# EAGLE design SwitchTester (EAGLE 7.7.0)
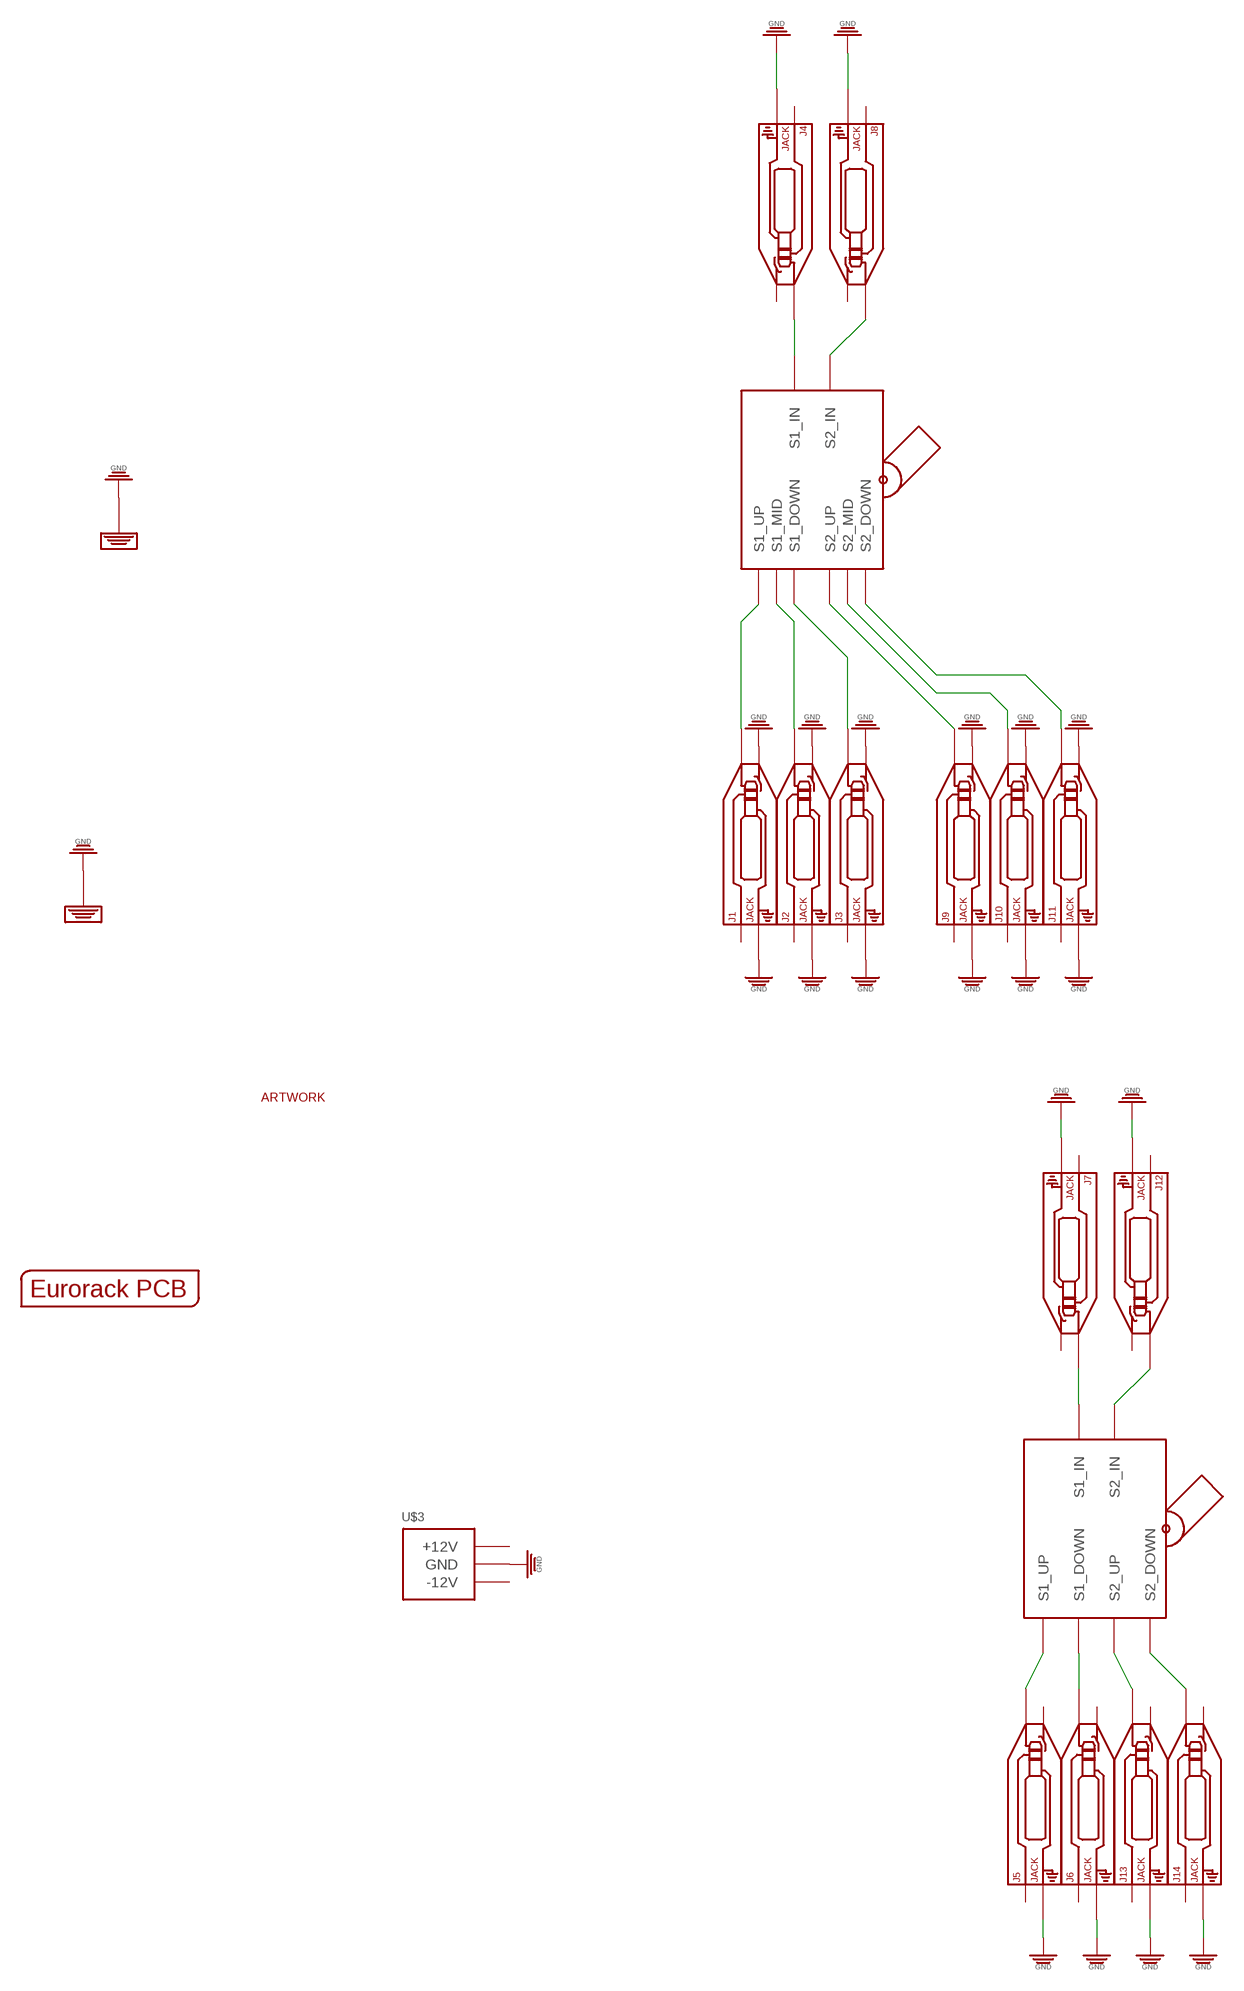
[diagram p0: schematic, sheet 1]

## Parts
J1  JACK  AUDIO-JACK_SMALLSYMBOLNODRILL  [3.5MM-JACK-SWITCH-13MM-NOHOLES]
J2  JACK  AUDIO-JACK_SMALLSYMBOLNODRILL  [3.5MM-JACK-SWITCH-13MM-NOHOLES]
J3  JACK  AUDIO-JACK_SMALLSYMBOLNODRILL  [3.5MM-JACK-SWITCH-13MM-NOHOLES]
J4  JACK  AUDIO-JACK_SMALLSYMBOLNODRILL  [3.5MM-JACK-SWITCH-13MM-NOHOLES]
J5  JACK  AUDIO-JACK_SMALLSYMBOLNODRILL  [3.5MM-JACK-SWITCH-13MM-NOHOLES]
J6  JACK  AUDIO-JACK_SMALLSYMBOLNODRILL  [3.5MM-JACK-SWITCH-13MM-NOHOLES]
J7  JACK  AUDIO-JACK_SMALLSYMBOLNODRILL  [3.5MM-JACK-SWITCH-13MM-NOHOLES]
J8  JACK  AUDIO-JACK_SMALLSYMBOLNODRILL  [3.5MM-JACK-SWITCH-13MM-NOHOLES]
J9  JACK  AUDIO-JACK_SMALLSYMBOLNODRILL  [3.5MM-JACK-SWITCH-13MM-NOHOLES]
J10  JACK  AUDIO-JACK_SMALLSYMBOLNODRILL  [3.5MM-JACK-SWITCH-13MM-NOHOLES]
J11  JACK  AUDIO-JACK_SMALLSYMBOLNODRILL  [3.5MM-JACK-SWITCH-13MM-NOHOLES]
J12  JACK  AUDIO-JACK_SMALLSYMBOLNODRILL  [3.5MM-JACK-SWITCH-13MM-NOHOLES]
J13  JACK  AUDIO-JACK_SMALLSYMBOLNODRILL  [3.5MM-JACK-SWITCH-13MM-NOHOLES]
J14  JACK  AUDIO-JACK_SMALLSYMBOLNODRILL  [3.5MM-JACK-SWITCH-13MM-NOHOLES]
PCB1  EURORACK_PCB6HP  [EURORACK6HPPCB]
U$1  TS-22E01  [TS-22E01]
U$2  TS-23E01  [TS-23E01]
U$3  POWER_SIMPLE10  [POWER_10]
U$4  TINRS_ARTWORKTINYDATE  [JUSTATINYROCKET_DATECODE]

## Nets
GND: J1.RING_B@1(RING) J1.RING_T@3(RING) J1.SWITCH_B@1(SWITCH) J1.SWITCH_T@3(SWITCH) J2.RING_B@1(RING) J2.RING_T@3(RING) J2.SWITCH_B@1(SWITCH) J2.SWITCH_T@3(SWITCH) J3.RING_B@1(RING) J3.RING_T@3(RING) J3.SWITCH_B@1(SWITCH) J3.SWITCH_T@3(SWITCH) J4.RING_B@1(RING) J4.RING_T@3(RING) J5.RING_B@1(RING) J5.RING_T@3(RING) J6.RING_B@1(RING) J6.RING_T@3(RING) J7.RING_B@1(RING) J7.RING_T@3(RING) J8.RING_B@1(RING) J8.RING_T@3(RING) J9.RING_B@1(RING) J9.RING_T@3(RING) J9.SWITCH_B@1(SWITCH) J9.SWITCH_T@3(SWITCH) J10.RING_B@1(RING) J10.RING_T@3(RING) J10.SWITCH_B@1(SWITCH) J10.SWITCH_T@3(SWITCH) J11.RING_B@1(RING) J11.RING_T@3(RING) J11.SWITCH_B@1(SWITCH) J11.SWITCH_T@3(SWITCH) J12.RING_B@1(RING) J12.RING_T@3(RING) J13.RING_B@1(RING) J13.RING_T@3(RING) J14.RING_B@1(RING) J14.RING_T@3(RING) U$1.P$9(GND) U$1.P$10(GND) U$1.P$11(GND) U$1.P$12(GND) U$2.P$9(GND) U$2.P$10(GND) U$2.P$11(GND) U$2.P$12(GND) U$3.3(GND) U$3.4(GND) U$3.5(GND) U$3.6(GND) U$3.7(GND) U$3.8(GND)
N$1: J4.TIP_B@1(TIP) J4.TIP_T@3(TIP) U$2.S1_SRC(S1_IN)
N$2: J8.TIP_B@1(TIP) J8.TIP_T@3(TIP) U$2.S2_SRC(S2_IN)
N$3: J1.TIP_B@1(TIP) J1.TIP_T@3(TIP) U$2.S1_UP
N$4: J2.TIP_B@1(TIP) J2.TIP_T@3(TIP) U$2.S1_MID
N$5: J3.TIP_B@1(TIP) J3.TIP_T@3(TIP) U$2.S1_DOWN
N$6: J9.TIP_B@1(TIP) J9.TIP_T@3(TIP) U$2.S2_UP
N$7: J10.TIP_B@1(TIP) J10.TIP_T@3(TIP) U$2.S2_MID
N$8: J11.TIP_B@1(TIP) J11.TIP_T@3(TIP) U$2.S2_DOWN
N$9: J6.TIP_B@1(TIP) J6.TIP_T@3(TIP) U$1.S1_DOWN U$1.S1_DOWN1(S1_DOWN)
N$10: J5.TIP_B@1(TIP) J5.TIP_T@3(TIP) U$1.S1_UP U$1.S1_UP1(S1_UP)
N$11: J7.TIP_B@1(TIP) J7.TIP_T@3(TIP) U$1.S1_SRC(S1_IN)
N$12: J12.TIP_B@1(TIP) J12.TIP_T@3(TIP) U$1.S2_SRC(S2_IN)
N$13: J13.TIP_B@1(TIP) J13.TIP_T@3(TIP) U$1.S2_UP U$1.S2_UP1(S2_UP)
N$14: J14.TIP_B@1(TIP) J14.TIP_T@3(TIP) U$1.S2_DOWN U$1.S2_DOWN1(S2_DOWN)
Unconnected: J1.SECOND_B@1(SECOND) J1.SECOND_T@3(SECOND) J2.SECOND_B@1(SECOND) J2.SECOND_T@3(SECOND) J3.SECOND_B@1(SECOND) J3.SECOND_T@3(SECOND) J4.SECOND_B@1(SECOND) J4.SECOND_T@3(SECOND) J4.SWITCH_B@1(SWITCH) J4.SWITCH_T@3(SWITCH) J5.SECOND_B@1(SECOND) J5.SECOND_T@3(SECOND) J5.SWITCH_B@1(SWITCH) J5.SWITCH_T@3(SWITCH) J6.SECOND_B@1(SECOND) J6.SECOND_T@3(SECOND) J6.SWITCH_B@1(SWITCH) J6.SWITCH_T@3(SWITCH) J7.SECOND_B@1(SECOND) J7.SECOND_T@3(SECOND) J7.SWITCH_B@1(SWITCH) J7.SWITCH_T@3(SWITCH) J8.SECOND_B@1(SECOND) J8.SECOND_T@3(SECOND) J8.SWITCH_B@1(SWITCH) J8.SWITCH_T@3(SWITCH) J9.SECOND_B@1(SECOND) J9.SECOND_T@3(SECOND) J10.SECOND_B@1(SECOND) J10.SECOND_T@3(SECOND) J11.SECOND_B@1(SECOND) J11.SECOND_T@3(SECOND) J12.SECOND_B@1(SECOND) J12.SECOND_T@3(SECOND) J12.SWITCH_B@1(SWITCH) J12.SWITCH_T@3(SWITCH) J13.SECOND_B@1(SECOND) J13.SECOND_T@3(SECOND) J13.SWITCH_B@1(SWITCH) J13.SWITCH_T@3(SWITCH) J14.SECOND_B@1(SECOND) J14.SECOND_T@3(SECOND) J14.SWITCH_B@1(SWITCH) J14.SWITCH_T@3(SWITCH) U$3.1(-12V) U$3.2(-12V) U$3.9(+12V) U$3.10(+12V)

## Library data of the parts
J1 = EurorackModularParts:AUDIO-JACK_SMALLSYMBOL: Switching Mono 3.5mm Audio Jack from Erthenvar.; DESC: 1 A
J2 = EurorackModularParts:AUDIO-JACK_SMALLSYMBOL: Switching Mono 3.5mm Audio Jack from Erthenvar.; DESC: 1 B
J3 = EurorackModularParts:AUDIO-JACK_SMALLSYMBOL: Switching Mono 3.5mm Audio Jack from Erthenvar.; DESC: 1 C
J4 = EurorackModularParts:AUDIO-JACK_SMALLSYMBOL: Switching Mono 3.5mm Audio Jack from Erthenvar.; DESC: 1
J5 = EurorackModularParts:AUDIO-JACK_SMALLSYMBOL: Switching Mono 3.5mm Audio Jack from Erthenvar.; DESC: 3 A
J6 = EurorackModularParts:AUDIO-JACK_SMALLSYMBOL: Switching Mono 3.5mm Audio Jack from Erthenvar.; DESC: 3 B
J7 = EurorackModularParts:AUDIO-JACK_SMALLSYMBOL: Switching Mono 3.5mm Audio Jack from Erthenvar.; DESC: 3
J8 = EurorackModularParts:AUDIO-JACK_SMALLSYMBOL: Switching Mono 3.5mm Audio Jack from Erthenvar.; DESC: 2
J9 = EurorackModularParts:AUDIO-JACK_SMALLSYMBOL: Switching Mono 3.5mm Audio Jack from Erthenvar.; DESC: 2 A
J10 = EurorackModularParts:AUDIO-JACK_SMALLSYMBOL: Switching Mono 3.5mm Audio Jack from Erthenvar.; DESC: 2 B
J11 = EurorackModularParts:AUDIO-JACK_SMALLSYMBOL: Switching Mono 3.5mm Audio Jack from Erthenvar.; DESC: 2 C
J12 = EurorackModularParts:AUDIO-JACK_SMALLSYMBOL: Switching Mono 3.5mm Audio Jack from Erthenvar.; DESC: 4
J13 = EurorackModularParts:AUDIO-JACK_SMALLSYMBOL: Switching Mono 3.5mm Audio Jack from Erthenvar.; DESC: 4 A
J14 = EurorackModularParts:AUDIO-JACK_SMALLSYMBOL: Switching Mono 3.5mm Audio Jack from Erthenvar.; DESC: 4 B
PCB1 = EurorackModularParts:EURORACK_PCB
U$1 = FenixBase:TS-22E01; DESC: Toggle; DOWN: Off; UP: On
U$2 = FenixBase:TS-23E01; DESC: Toggle; DOWN: 3; MID: 2; UP: 1
U$3 = EurorackModularParts:POWER_SIMPLE
U$4 = EurorackModularParts:TINRS_ARTWORK

## Net classes
0 default: width 0.381 mm

## Board
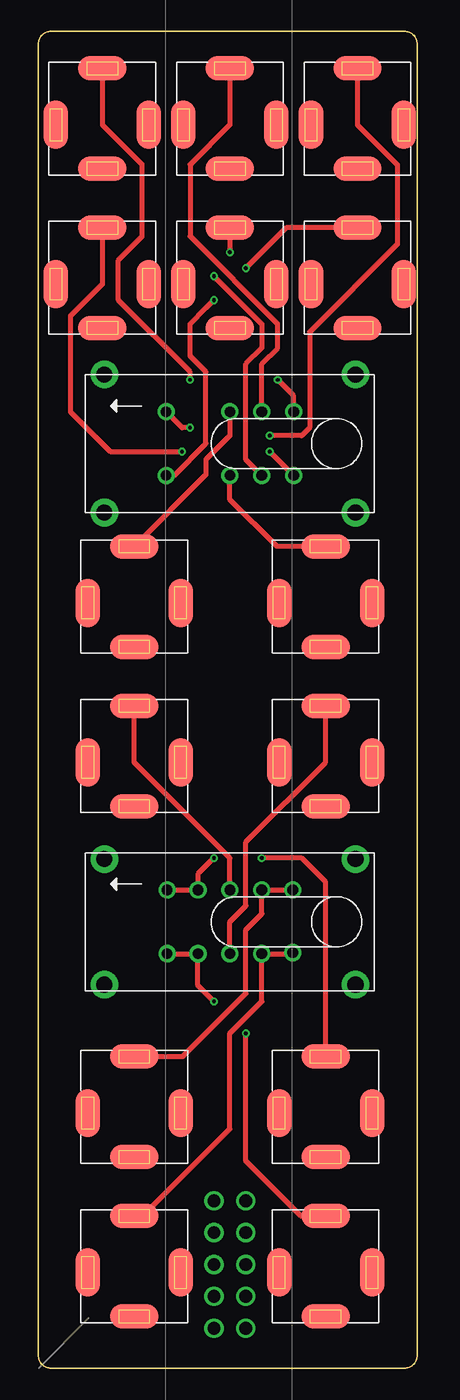
[diagram p1: board, top side]
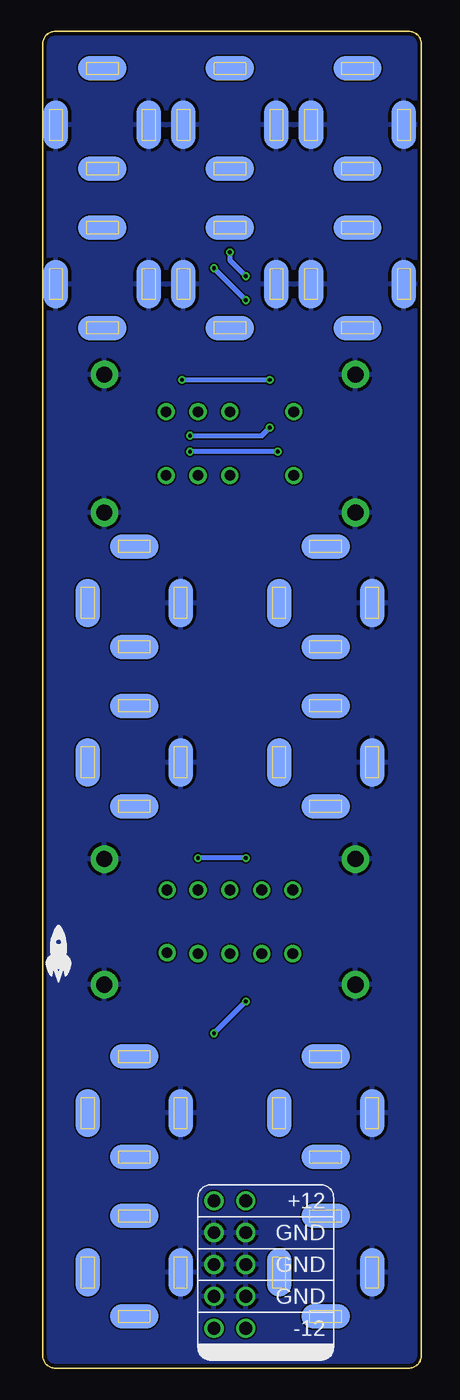
[diagram p2: board, bottom side, seen from below]

Size 30.16 x 106.5 mm. Coordinates in mm from the lower left corner, seen from the top.
Copper layers (1*16): Top 0.035mm / dielectric 1.5mm / Bottom 0.035mm
Design rules "dirt_cheap_dirty_boards.v1": minimum track width 5mil, minimum drill 12mil, track to track 5mil, track to pad 5mil, pad to pad 5mil, via to via 5mil, smd to smd 0mil, copper to edge 10mil, drill to drill 10mil, minimum pad ring 10mil, minimum via ring 6mil, stop-mask expansion 2mil, vias tented up to drill 25mil, thermal gap 10mil

### Footprints (pad centres in the part's own frame; a part is rotated, then mirrored left to right if it is on the bottom)
3.5MM-JACK-SWITCH-13MM-NOHOLES = smd 1.95 x 3.85 bottom: RING_B@1 -3.7,0; SWITCH_B@1 3.7,0 | smd 1.95 x 3.85: RING_T@3 -3.7,0; SWITCH_T@3 3.7,0 | smd 3.85 x 1.95 bottom: SECOND_B@1 0,-3.5; TIP_B@1 0,4.5 | smd 3.85 x 1.95: SECOND_T@3 0,-3.5; TIP_T@3 0,4.5
TS-22E01 = drill 1.3 pad 2.2: P$9 -10,5; P$10 -10,-5; P$11 10,5; P$12 10,-5 | drill 0.85: S1_DOWN -2.54,2.54; S1_DOWN1 -5,2.54; S1_SRC 0,2.54; S1_UP 2.54,2.54; S1_UP1 5,2.54; S2_DOWN -2.54,-2.54; S2_DOWN1 -5,-2.54; S2_SRC 0,-2.54; S2_UP 2.54,-2.54; S2_UP1 5,-2.46
TS-23E01 = drill 1.3 pad 2.2: P$9 -10,5.5; P$10 -10,-5.5; P$11 10,5.5; P$12 10,-5.5 | drill 0.85: S1_DOWN -5.08,2.54; S1_MID 2.54,2.54; S1_SRC 0,2.54; S1_UP 5.08,2.54; S2_DOWN -5.08,-2.54; S2_MID 2.54,-2.54; S2_SRC 0,-2.54; S2_UP 5.08,-2.54
POWER_10 = drill 1.016: 1 -5.08,-1.27; 2 -5.08,1.27; 3 -2.54,-1.27; 4 -2.54,1.27; 5 0,-1.27; 6 0,1.27; 7 2.54,-1.27; 8 2.54,1.27; 9 5.08,-1.27; 10 5.08,1.27

### Placement (x,y rotation side)
J1  5.09,99.06 0 top
J2  15.25,99.06 0 top
J3  25.41,99.06 0 top
J4  7.63,60.96 0 top
J5  7.63,20.32 0 top
J6  22.87,20.32 0 top
J7  7.63,48.26 0 top
J8  22.87,60.96 0 top
J9  5.09,86.36 0 top
J10  15.25,86.36 0 top
J11  25.41,86.36 0 top
J12  22.87,48.26 0 top
J13  7.63,7.62 0 top
J14  22.87,7.62 0 top
PCB1  0.01,0 0 top
U$1  15.25,35.56 0 top
U$2  15.25,73.66 0 top
U$3  15.25,8.26 90 bottom
U$4  28.9,33.02 0 bottom

### Tracks (layer width: path | path; a pad name or v marks a point on that pad's centre or on a via)
GND
  pour Bottom: -2.53,109.22 38.11,109.22 38.11,-7.62 -2.53,-7.62
N$1
  Top 0.381: U$2.S1_SRC 15.25,74.3 13.34,72.39 13.34,71.17 J4.TIP_B@1
N$2
  Top 0.381: J8.TIP_B@1 19,65.46 15.25,69.22 U$2.S2_SRC
N$3  (via drill 0.3)
  Top 0.381: J1.TIP_B@1 5.09,99.06 8.26,95.89 8.26,90.17 6.36,88.27 6.36,85.09 12.07,79.38 v12.07,78.74 | U$2.S1_UP 20.33,77.47 v19.06,78.74
  Bottom 0.381: v19.06,78.74 v12.07,78.74
N$4
  Top 0.381: J2.TIP_B@1 15.25,99.06 12.07,95.89 12.07,90.17 19.06,83.19 19.06,81.28 17.79,80.01 U$2.S1_MID
N$5  (via drill 0.3)
  Top 0.381: J3.TIP_B@1 25.41,99.06 28.58,95.89 28.58,89.53 21.6,82.55 21.6,74.93 20.96,74.3 v18.42,74.3 | v12.07,74.93 11.44,74.93 U$2.S1_DOWN
  Bottom 0.381: v18.42,74.3 12.71,74.3 v12.07,74.93
N$6  (via drill 0.3)
  Top 0.381: J9.TIP_B@1 5.09,86.36 2.55,83.82 2.55,76.2 5.72,73.03 v11.44,73.03 | v18.42,73.03 U$2.S2_UP
  Bottom 0.381: v11.44,73.03 v18.42,73.03
N$7  (via drill 0.3)
  Top 0.381: U$2.S2_MID 16.52,72.39 16.52,80.01 17.79,81.28 17.79,83.19 v13.98,87 | J10.TIP_B@1 v15.25,88.9
  Bottom 0.381: v15.25,88.9 15.25,88.27 v13.98,87
N$8  (via drill 0.3)
  Top 0.381: U$2.S2_DOWN 10.8,71.12 13.34,73.66 13.34,79.38 12.07,80.64 12.07,83.19 13.34,84.45 v13.98,85.09 | J11.TIP_B@1 19.75,90.86 v16.52,87.63
  Bottom 0.381: v16.52,87.63 v13.98,85.09
N$9  (via drill 0.3)
  Top 0.381: J6.TIP_B@1 22.87,38.73 20.96,40.64 v17.79,40.64 | v13.98,40.64 12.71,39.37 U$1.S1_DOWN U$1.S1_DOWN1
  Bottom 0.381: v13.98,40.64 v17.79,40.64
N$10
  Top 0.381: J5.TIP_B@1 11.49,24.82 16.52,29.84 16.52,34.92 17.79,36.2 U$1.S1_UP U$1.S1_UP1
N$11
  Top 0.381: U$1.S1_SRC 15.25,40.64 7.63,48.26 J7.TIP_B@1
N$12
  Top 0.381: U$1.S2_SRC 15.25,35.56 16.52,36.83 16.52,41.91 22.87,48.26 J12.TIP_B@1
N$13
  Top 0.381: J13.TIP_B@1 8.32,12.12 15.25,19.05 15.25,26.67 17.79,29.21 U$1.S2_UP 20.17,33.02 U$1.S2_UP1
N$14  (via drill 0.3)
  Top 0.381: J14.TIP_B@1 20.91,12.12 16.52,16.51 v16.52,26.67 | v13.98,29.21 12.71,30.48 U$1.S2_DOWN U$1.S2_DOWN1
  Bottom 0.381: v16.52,26.67 v13.98,29.21